# Altium schematic sheet PAGE2-CONNECTIONS.SchDoc
size A3
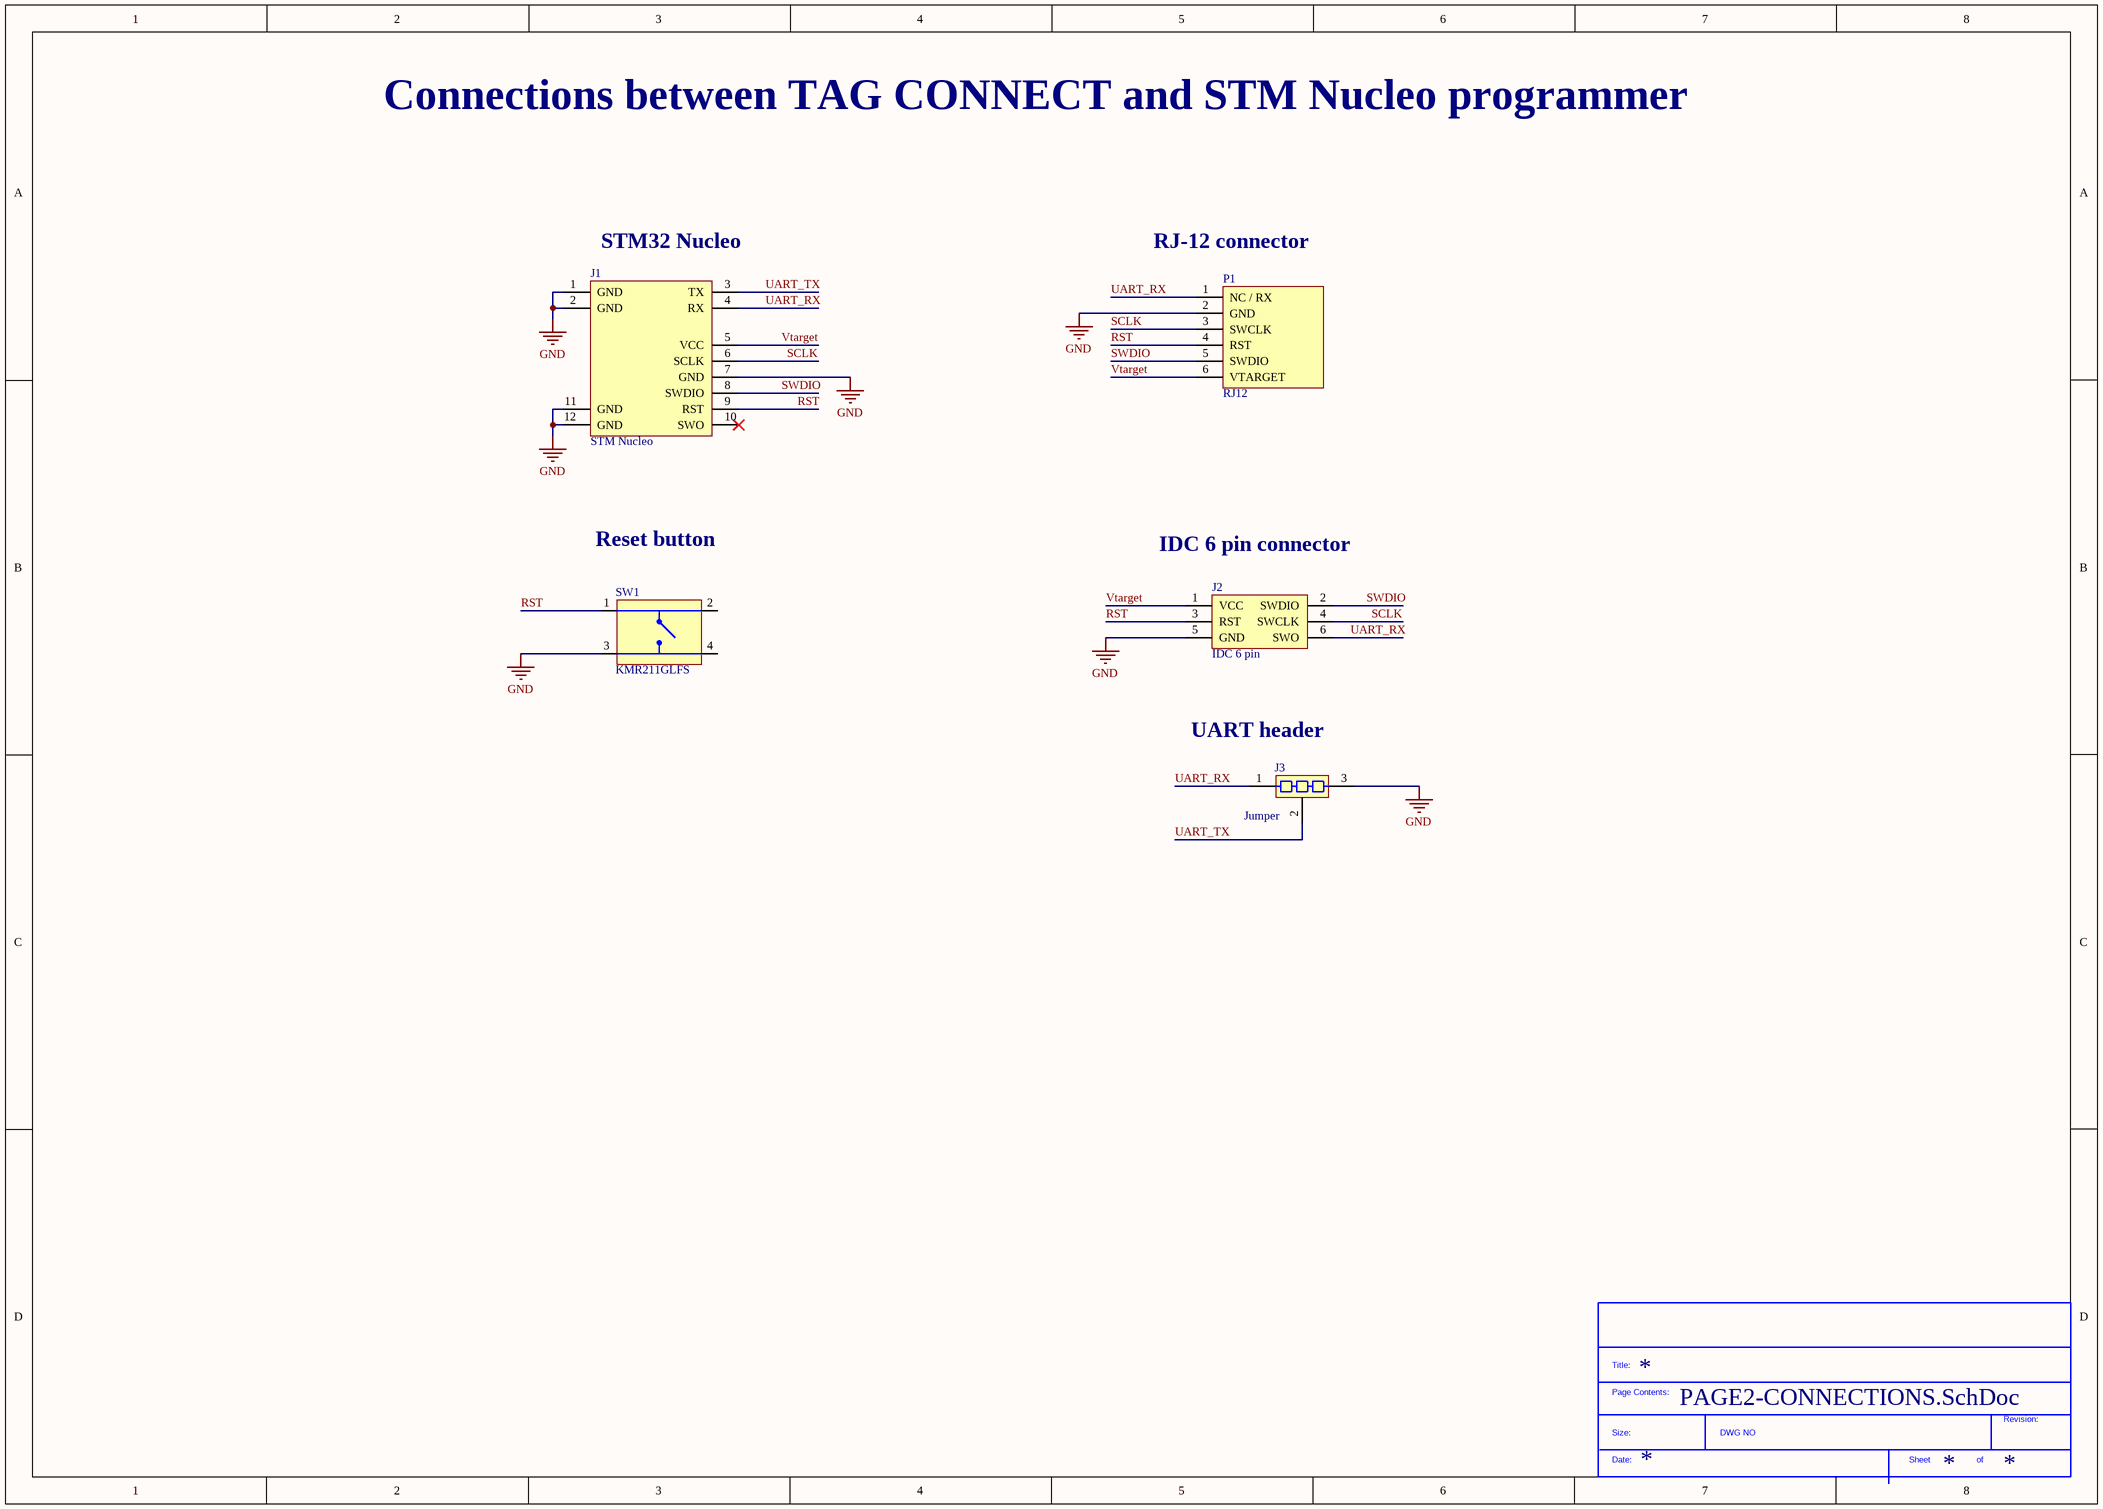
[diagram p0: PAGE2-CONNECTIONS.SchDoc]

## Parts
*?  SDTitleBlock  (value not drawn)  (graphical)
J1  STM Nucleo  [NUCLEO F4 HEADERS]
J2  IDC 6 pin  [IDC 6 pin]
J3  Jumper  [JUMPER]
P1  RJ12  [RJ12]
SW1  KMR211GLFS  [Button]

## Nets
GND: J1.1(GND) J1.2(GND) J1.7(GND) J1.11(GND) J1.12(GND) J2.5(GND) J3.3 P1.2(GND) SW1.3
RST: J1.9(RST) J2.3(RST) P1.4(RST) SW1.1
SCLK: J1.6(SCLK) J2.4(SWCLK) P1.3(SWCLK)
SWDIO: J1.8(SWDIO) J2.2(SWDIO) P1.5(SWDIO)
UART_RX: J1.4(RX) J2.6(SWO) J3.1 P1.1(NC_/_RX)
UART_TX: J1.3(TX) J3.2
Vtarget: J1.5(VCC) J2.1(VCC) P1.6(VTARGET)

Not connected (* = marked no-connect by the designer): J1 10(SWO)*; SW1 2 4

## Notes on the sheet
- Connections between TAG CONNECT and STM Nucleo programmer
- (near J1) STM32 Nucleo
- (near P1) RJ-12 connector
- Reset button
- (near J2) IDC 6 pin connector
- (near J3) UART header
- (in symbol SDTitleBlock) Title:; Page Contents:; Revision:; Size:; DWG NO; Date:; Sheet; of

## Library data of the parts
J2 = 90130-1206: Headers & Wire Housings 2.54MM CGRIDIII HDR 6P V DR SHRD AU-E; Manufacturer: Molex; Number of Contacts: 6; Max Voltage Rating (DC): 350.35kV; Contact Resistance: 20mR; Max Voltage Rating (AC): 500V; Current Rating: 3A; Voltage Rating: 350V; Max Current Rating: 3.9A; Insulation Resistance: 5GR; Gender: Male; Glow Wire Compliant: Non-compliant; Supplier 1: Farnell; Manufacturer Part Number: 90130-1206; Stock 1: 1896; Pricing 1: 1=1.07, 50=1, 100=0.934, 250=0.84, 500=0.775, 1000=0.619 (EUR); Mount: Through Hole; Contact Plating: Gold; Contact Material: Brass,Bronze,Copper; Housing Color: Black; Color: Black; Housing Material: Polyester; Material: Glass,Polyester; Min Operating Temperature: -55°C; Max Operating Temperature: 125°C; Number of Rows: 2; Termination: Solder; Packaging: Tray; Number of Positions: 6; Orientation: Vertical; Package Quantity: 2560; Number of Poles: 6; Voltage Rating (AC): 350V; Contact Gender: Male; Working Voltage: 350V; Voltage Rating (DC): 350V; Number of Circuits: 6; Length: 8mm; Height: 4.7mm; Pitch: 2.54mm; Row Spacing: 2.54mm; Depth: 3.94mm; Lead Pitch: 2.54mm; Radiation Hardening: No; REACH SVHC: Unknown; Lead Free: Lead Free; ComponentLink1URL: http://www.mouser.com/ds/2/276/0901301206_PCB_HEADERS-151694.pdf?src-supplier=Mouser; ComponentLink1Description: http://www.mouser.com/ds/2/276/0901301206_PCB_HEADERS-151694.pdf?src-supplier=Mouser; ComponentLink2URL: http://www.jameco.com/Jameco/Products/ProdDS/1978810.pdf?src-supplier=Jameco; ComponentLink2Description: http://www.jameco.com/Jameco/Products/ProdDS/1978810.pdf?src-supplier=Jameco; ComponentLink3URL: http://www.molex.com/webdocs/datasheets/pdf/en-us/0901301206_PCB_HEADERS.pdf?src-supplier=Avnet+Europe; ComponentLink3Description: http://www.molex.com/webdocs/datasheets/pdf/en-us/0901301206_PCB_HEADERS.pdf?src-supplier=Avnet+Europe; ComponentLink4URL: http://www.molex.com/webdocs/datasheets/pdf/en-us/0901301206_PCB_HEADERS.pdf?src-supplier=Avnet; ComponentLink4Description: http://www.molex.com/webdocs/datasheets/pdf/en-us/0901301206_PCB_HEADERS.pdf?src-supplier=Avnet; ComponentLink5URL: http://uk.rs-online.com/webdocs/13c4/0900766b813c4c7b.pdf?src-supplier=RSComponents; ComponentLink5Description: http://uk.rs-online.com/webdocs/13c4/0900766b813c4c7b.pdf?src-supplier=RSComponents; Supplier Part Number 1: 9733884
J3 = Jumper: 3 pin jumper
P1 = 95501-2661: MODULAR, JACK, THT, R/A, RJ11, 6P6C; Manufacturer: Molex; Shielding: Unshielded; Max Voltage Rating (DC): 125V; Number of Ports: 1; Current Rating: 1.5A; Gender: Female; Number of Contacts: 6; Insulation Resistance: 500MR; Pitch: 2.54mm; Approvals: UL; Supplier 1: Farnell; Manufacturer Part Number: 95501-2661; Stock 1: 7441; Pricing 1: 10=0.565, 100=0.492, 500=0.443, 1000=0.394, 2500=0.356, 5000=0.344 (EUR); Mount: Through Hole; Contact Plating: Gold; Contact Material: Copper Alloy,Bronze; Housing Material: Thermoplastic; Color: Black; Insulation Material: Polyester; Min Operating Temperature: -40°C; Max Operating Temperature: 80°C; Packaging: Tray; Package Quantity: 3276; Termination: Through Hole; Orientation: Right Angle; Voltage Rating (DC): 125V; Number of Positions: 6; Length: 13.21mm; Depth: 18.1mm; Width: 11.5mm; REACH SVHC: Unknown; Halogen Free: Low Halogen; Lead Free: Lead Free; Flammability Rating: UL94 V-0; ComponentLink1URL: http://uk.rs-online.com/webdocs/13c4/0900766b813c4eac.pdf?src-supplier=RSComponents; ComponentLink1Description: http://uk.rs-online.com/webdocs/13c4/0900766b813c4eac.pdf?src-supplier=RSComponents; ComponentLink2URL: http://www.farnell.com/cad/1597654.pdf?src-supplier=Element14; ComponentLink2Description: http://www.farnell.com/cad/1597654.pdf?src-supplier=Element14; ComponentLink3URL: http://www.mouser.com/ds/2/276/0955012661_MODULAR_JACKS_PLUG-177638.pdf?src-supplier=Mouser; ComponentLink3Description: http://www.mouser.com/ds/2/276/0955012661_MODULAR_JACKS_PLUG-177638.pdf?src-supplier=Mouser; ComponentLink4URL: http://www.onlinecomponents.com/productFiles/mf-MOL/360890955012661_modular_jacks_plug.pdf?src-supplier=Onlinecomponents.com; ComponentLink4Description: http://www.onlinecomponents.com/productFiles/mf-MOL/360890955012661_modular_jacks_plug.pdf?src-supplier=Onlinecomponents.com; Supplier Part Number 1: 1536490
SW1 = KMR211GLFS: SWITCH TACTILE SPST-NO 0.05A 32V; Manufacturer: ITT C&K; Mechanical Life: 200000Cycles; Operating Force: 1.2N; Throw Configuration: SPST; Max Current Rating: 50mA; Power Rating: 1W; Illumination Type: Non-Illuminated,Illuminated; Switch Travel: 0.2mm; Switch Function: Off-Mom; Actuator Type: Standard; Actuator Length: 0.5mm; Supplier 1: Farnell; Manufacturer Part Number: KMR211GLFS; Stock 1: 0; Mount: Surface Mount; Contact Material: Silver; Contact Plating: Silver; Min Operating Temperature: -40°C; Max Operating Temperature: 85°C; Max Voltage Rating (DC): 32V; Termination: Gull Wing; Packaging: Tape and Reel; Orientation: Straight; Contact Current Rating: 50mA; Voltage Rating (DC): 32V; Package Quantity: 1; Current Rating: 50mA; Length: 2.8mm; Depth: 4.6mm; Width: 2.8mm; Radiation Hardening: No; REACH SVHC: No SVHC; Lead Free: Lead Free; ComponentLink1URL: http://uk.rs-online.com/webdocs/129c/0900766b8129c9f0.pdf?src-supplier=RSComponents; ComponentLink1Description: http://uk.rs-online.com/webdocs/129c/0900766b8129c9f0.pdf?src-supplier=RSComponents; ComponentLink2URL: http://www1.futureelectronics.com/doc/C%20-%20K%20COMPONENTS/KMR211GLFS.pdf?src-supplier=Future+Electronics; ComponentLink2Description: http://www1.futureelectronics.com/doc/C%20-%20K%20COMPONENTS/KMR211GLFS.pdf?src-supplier=Future+Electronics; ComponentLink3URL: http://www.farnell.com/datasheets/2044619.pdf?src-supplier=Element14; ComponentLink3Description: http://www.farnell.com/datasheets/2044619.pdf?src-supplier=Element14; ComponentLink4URL: http://www.ck-components.com/14414/kmr2_9aug12.pdf/?src-supplier=Avnet; ComponentLink4Description: http://www.ck-components.com/14414/kmr2_9aug12.pdf/?src-supplier=Avnet; ComponentLink5URL: http://www.ck-components.com/14414/kmr2_9aug12.pdf/?src-supplier=Avnet+Europe; ComponentLink5Description: http://www.ck-components.com/14414/kmr2_9aug12.pdf/?src-supplier=Avnet+Europe; ComponentLink6URL: https://www.ckswitches.com/media/1479/kmr2.pdf?src-supplier=Digi-Key; ComponentLink6Description: https://www.ckswitches.com/media/1479/kmr2.pdf?src-supplier=Digi-Key; ComponentLink7URL: http://www.ckswitches.com/media/1479/kmr2.pdf?src-supplier=Onlinecomponents.com; ComponentLink7Description: http://www.ckswitches.com/media/1479/kmr2.pdf?src-supplier=Onlinecomponents.com; Supplier Part Number 1: 1437635RL